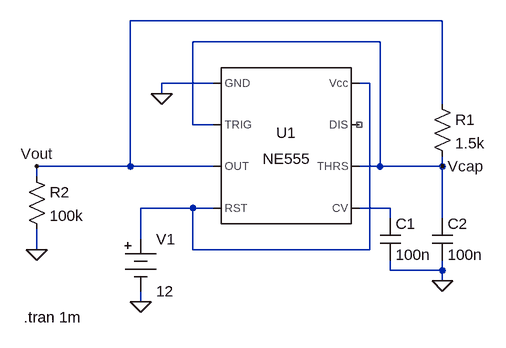
[diagram p0: schematic 3_12_pablo_gomez_tp7_ej1_single_r.asc]
3_12_pablo_gomez_tp7_ej1_single_r.asc, the LTspice schematic file:
Version 4
SHEET 1 880 680
WIRE 400 -48 -80 -48
WIRE 304 -16 16 -16
WIRE 48 48 -32 48
WIRE 288 48 272 48
WIRE -32 64 -32 48
WIRE 400 80 400 -48
WIRE 16 112 16 -16
WIRE 48 112 16 112
WIRE -80 176 -80 -48
WIRE -80 176 -224 176
WIRE 48 176 -80 176
WIRE 304 176 304 -16
WIRE 304 176 272 176
WIRE 400 176 400 160
WIRE 400 176 304 176
WIRE -224 192 -224 176
WIRE 16 240 -64 240
WIRE 48 240 16 240
WIRE 320 240 272 240
WIRE 320 256 320 240
WIRE 400 256 400 176
WIRE -64 288 -64 240
WIRE -224 304 -224 272
WIRE 16 304 16 240
WIRE 288 304 288 48
WIRE 288 304 16 304
WIRE 320 336 320 320
WIRE 400 336 400 320
WIRE 400 336 320 336
WIRE 400 352 400 336
WIRE -64 384 -64 368
FLAG 400 352 0
FLAG -32 64 0
FLAG -64 384 0
FLAG -224 304 0
FLAG -224 176 Vout
FLAG 400 176 Vcap
SYMBOL Misc\\NE555 160 144 R0
SYMATTR InstName U1
SYMBOL Misc\\battery -64 272 R0
WINDOW 123 0 0 Left 0
WINDOW 39 0 0 Left 0
SYMATTR InstName V1
SYMATTR Value 12
SYMBOL res 384 64 R0
SYMATTR InstName R1
SYMATTR Value 1.5k
SYMBOL cap 304 256 R0
SYMATTR InstName C1
SYMATTR Value 100n
SYMBOL cap 384 256 R0
SYMATTR InstName C2
SYMATTR Value 100n
SYMBOL res -240 176 R0
SYMATTR InstName R2
SYMATTR Value 100k
TEXT -244 408 Left 2 !.tran 1m

The netlist it stands for:
* 3_12_pablo_gomez_tp7_ej1_single_r.asc
XU1 0 Vcap Vout N001 N002 Vcap NC_01 N001 NE555  ; pins GND TRIG OUT RST CV THRS DIS Vcc
V1 N001 0 12
R1 Vout Vcap 1.5k
C1 N002 0 100n
C2 Vcap 0 100n
R2 Vout 0 100k
.tran 1m
.lib NE555.sub
.backanno
.end